# EAGLE design Board_4_Buttons_WS-TASV-4-IP67 (EAGLE 9.6.2)
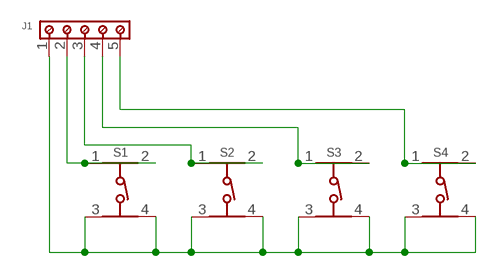
[diagram p0: schematic, sheet 1]

## Parts
J1  691709710305  [691709710305]
S1  430773034825  [430773034825]
S2  430773034825  [430773034825]
S3  430773034825  [430773034825]
S4  430773034825  [430773034825]

## Nets
N$1: J1.1 S1.3 S1.4 S2.3 S2.4 S3.3 S3.4 S4.3 S4.4
N$5: J1.2 S1.1 S1.2
N$6: J1.3 S2.1 S2.2
N$7: J1.4 S3.1 S3.2
N$8: J1.5 S4.1 S4.2

## Library data of the parts
J1 = Wurth_Connectors_WR-TBL Rising Cage Clamp:691709710305: WR-TBL Series 7097 - Rising Cage Clamp 5.0mm pitch - Horizontal cable entry - SMT Kind Properties Pitch 5 mm General Information Operating Temperature -40 up to +130 °C Compliance RoHS Electrical Properties IR cULus 6 A Working Voltage [cULus] 300 V (AC) Withstanding Voltage [cULus] 1600 V (AC) Contact Resistance [cULus] 20 mΩ Mechanical Properties Wire Strip Length 7 up to 8 (mm) Screw M3 Material Properties Insulator Material PA46 Insulator Flammability Rating UL94 V-0 Pin Material Brass Pin Plating Tin over Nickel Cage Material Brass Cage Plating Nickel Terminal Screw Material Steel Terminal Screw Plating Zinc Screw M3 Certification cULus Approval E315414 Packaging Properties Packaging Tape and Reel with Cap Wire Properties Wire Strip Length 7 up to 8 (mm) Solid Wire Section (AWG) 30 to 14 (AWG) Solid Wire Section (Metric) 0.2 to 1.5 (mm²) Stranded Wire Section (AWG) 30 to 14 (AWG) Stranded Wire Section (Metric) 0.2 to 1.5 (mm²) <https://www.we-online.com/components/media/o58289v209%20Family_WR-TBL_Serie_7097_6917097103xx.jpg> Details see: www.we-online.com/components/products/TBL_5_00_SMT_7097_HORIZONTAL_ENTRY_SMT_RISING_CAGE_CLAMP_69170971030X <www.we-online.com/catalog/TBL_5_00_SMT_7097_HORIZONTAL_ENTRY_SMT_RISING_CAGE_CLAMP_69170971030X/?utm_source=eagle_model&utm_medium=description_link&utm_campaign=eisos_eagle> Updated by Ella Wu 2023-08-23 2023(C) Wurth Elektronik; DATASHEET-URL: https://www.we-online.com/redexpert/spec/691709710305?ae; IR-UL: 6A; MOUNT: THT; PART-NUMBER: 691709710305; PINS: 5; PITCH: 5mm; TYPE: Horizontal; WIRE: 33 to 14 (AWG) 0.2 to 1.5 (mm²); WORKING-VOLTAGE-UL: 300V (AC)
S1-S4 = Wurth_Switch_WS-TASV:430773034825: WS-TASV J-Hook SMT IP67 Tact Switch 6x6 mm General Information Operating Temperature -40 up to +85 °C Washable Yes Ingress Protection Code IP67 Electrical Properties IR 50 mA VR 12 V (DC) Contact Resistance Initial 100 mΩ RISO 100 MΩ Withstanding Voltage 250 V (AC) Packaging Properties Packaging Tape and Reel Material Properties Actuator Material Silicone Rubber Actuator Flammability Rating UL94 HB Frame Material HTN Frame Flammability Rating UL94 V-0 Contact Plating Silver Terminal Plating Silver Mechanical Properties Operation Force (Value) 160 g; 250 g; 320 g Electrical Life 200000 Cycles; 500000 Cycles; 1000000 Cycles <https://www.we-online.com/components/media/o94204v209%20Family-WS-TASV-4307x30xx8xx.jpg> Details see: www.we-online.com/en/components/products/TASV_6X6_SMD_J-BEND_HERMETIC <www.we-online.com/catalog/TASV_6X6_SMD_J-BEND_HERMETIC/?utm_source=eagle_model&utm_medium=description_link&utm_campaign=eisos_eagle> Updated by Ella 2023-12-04 2023(C) Würth Elektronik; ACTUATOR-COLOR: Grey; DATASHEET-URL: https://www.we-online.com/redexpert/spec/430773034825?ae; ELECTRICAL-LIFE: 500000Cycles; HEIGHT: 3.4mm; MOUNT: SMT; OPERATION-FORCE: 250g; PART-NUMBER: 430773034825

## Board
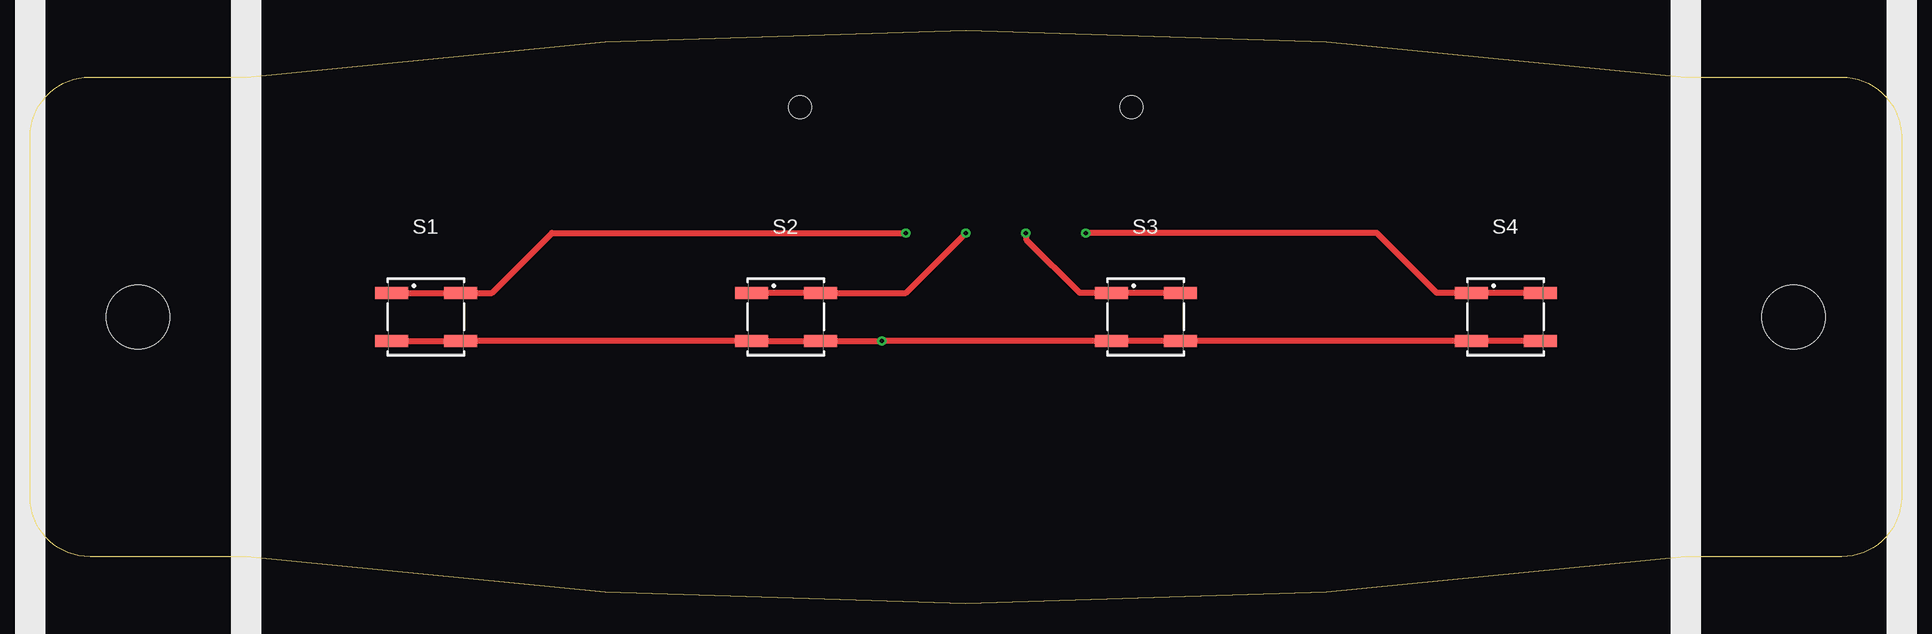
[diagram p1: board, top side]
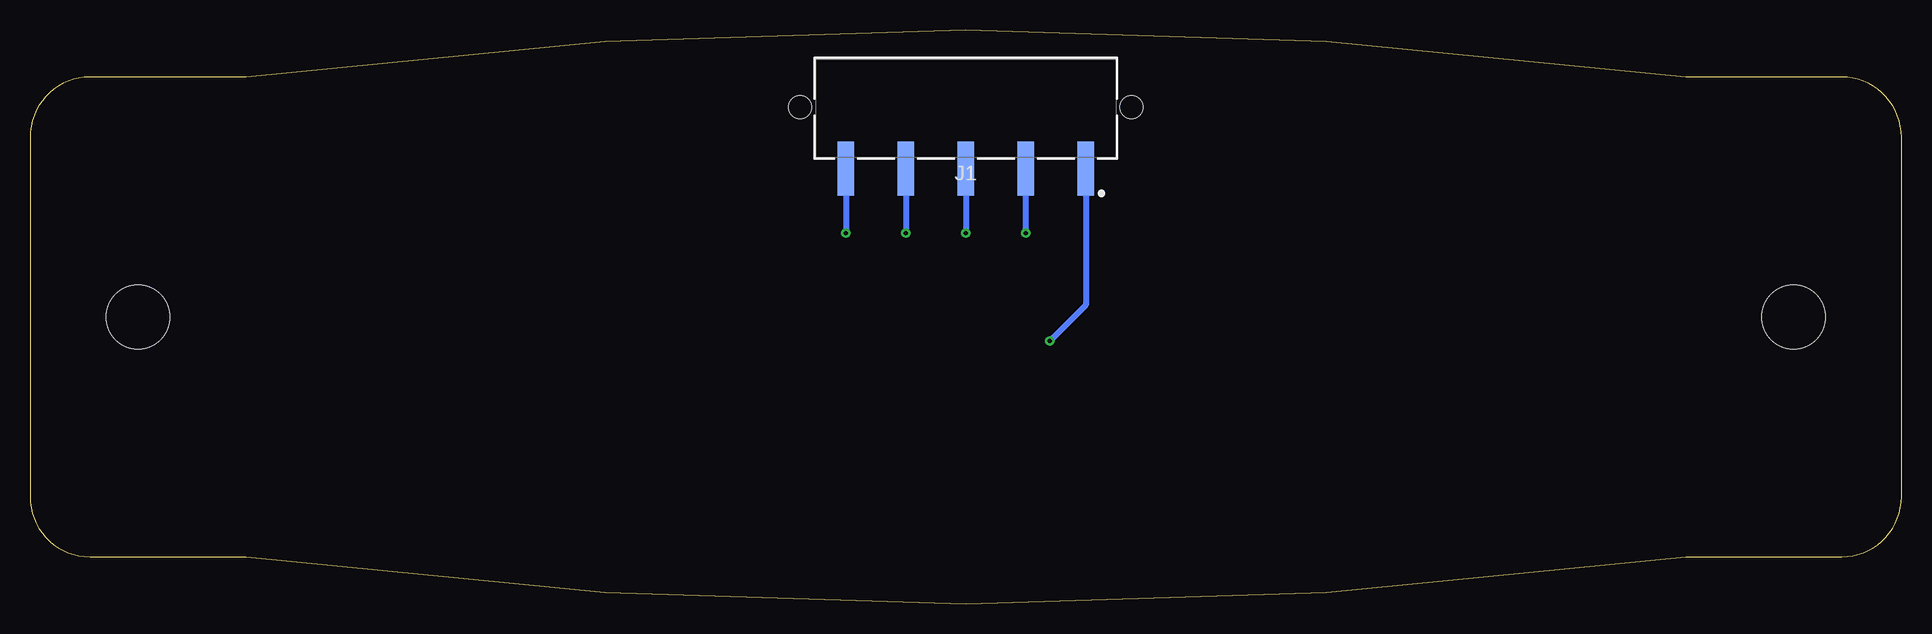
[diagram p2: board, bottom side, seen from below]

Size 156 x 47.87 mm. Coordinates in mm from the lower left corner, seen from the top.
Outline: 18,3.93 5,3.93 arc-90 0,8.93 0,38.93 arc-90 5,43.93 18,43.93 arc-15 138,43.93 151,43.93 arc-90 156,38.93 156,8.93 arc-90 151,3.93 138,3.93 arc-15 18,3.93
Copper layers (1*16): Top 0.035mm / dielectric 1.5mm / Bottom 0.035mm
Design rules "default *": minimum track width 6mil, minimum drill 0.35mm, track to track 6mil, track to pad 6mil, pad to pad 6mil, via to via 6mil, smd to smd 6mil, copper to edge 40mil, drill to drill 6mil, minimum pad ring 0.45mm, minimum via ring 8mil, stop-mask expansion 4mil, vias tented up to drill 4mm, thermal gap 10mil
Holes 5.3 mm at 9,23.93 147,23.93

### Footprints (pad centres in the part's own frame; a part is rotated, then mirrored left to right if it is on the bottom)
691709710305 = smd 1.4 x 4.5: 1 -10,5.15; 2 -5,5.15; 3 0,5.15; 4 5,5.15; 5 10,5.15 | hole 1.9: -13.8,0; 13.8,0
430773034825 = smd 2.75 x 1: 1 -2.875,2; 2 2.875,2; 3 -2.875,-2; 4 2.875,-2

### Placement (x,y rotation side)
J1  78,41.43 180 bottom
S1  33,23.93 0 top
S2  63,23.93 0 top
S3  93,23.93 0 top
S4  123,23.93 0 top

### Tracks (layer width: path | path; a pad name or v marks a point on that pad's centre or on a via)
N$1  (via drill 0.35)
  Top 0.508: S1.3 S1.4 S2.3 S2.4 v71,21.93 S3.3 S3.4 S4.3 S4.4
  Bottom 0.508: J1.1 68,24.93 v71,21.93
N$5  (via drill 0.35)
  Top 0.508: v73,30.93 43.5,30.93 38.5,25.93 S1.2 S1.1
  Bottom 0.508: v73,30.93 J1.2
N$6  (via drill 0.35)
  Top 0.508: S2.1 S2.2 73,25.93 v78,30.93
  Bottom 0.508: J1.3 v78,30.93
N$7  (via drill 0.35)
  Top 0.508: v83,30.93 83.08,30.85 83.08,30.35 87.5,25.93 S3.1 S3.2
  Bottom 0.508: J1.4 v83,30.93
N$8  (via drill 0.35)
  Top 0.508: v88,30.93 112.25,30.93 117.25,25.93 S4.1 S4.2
  Bottom 0.508: J1.5 v88,30.93